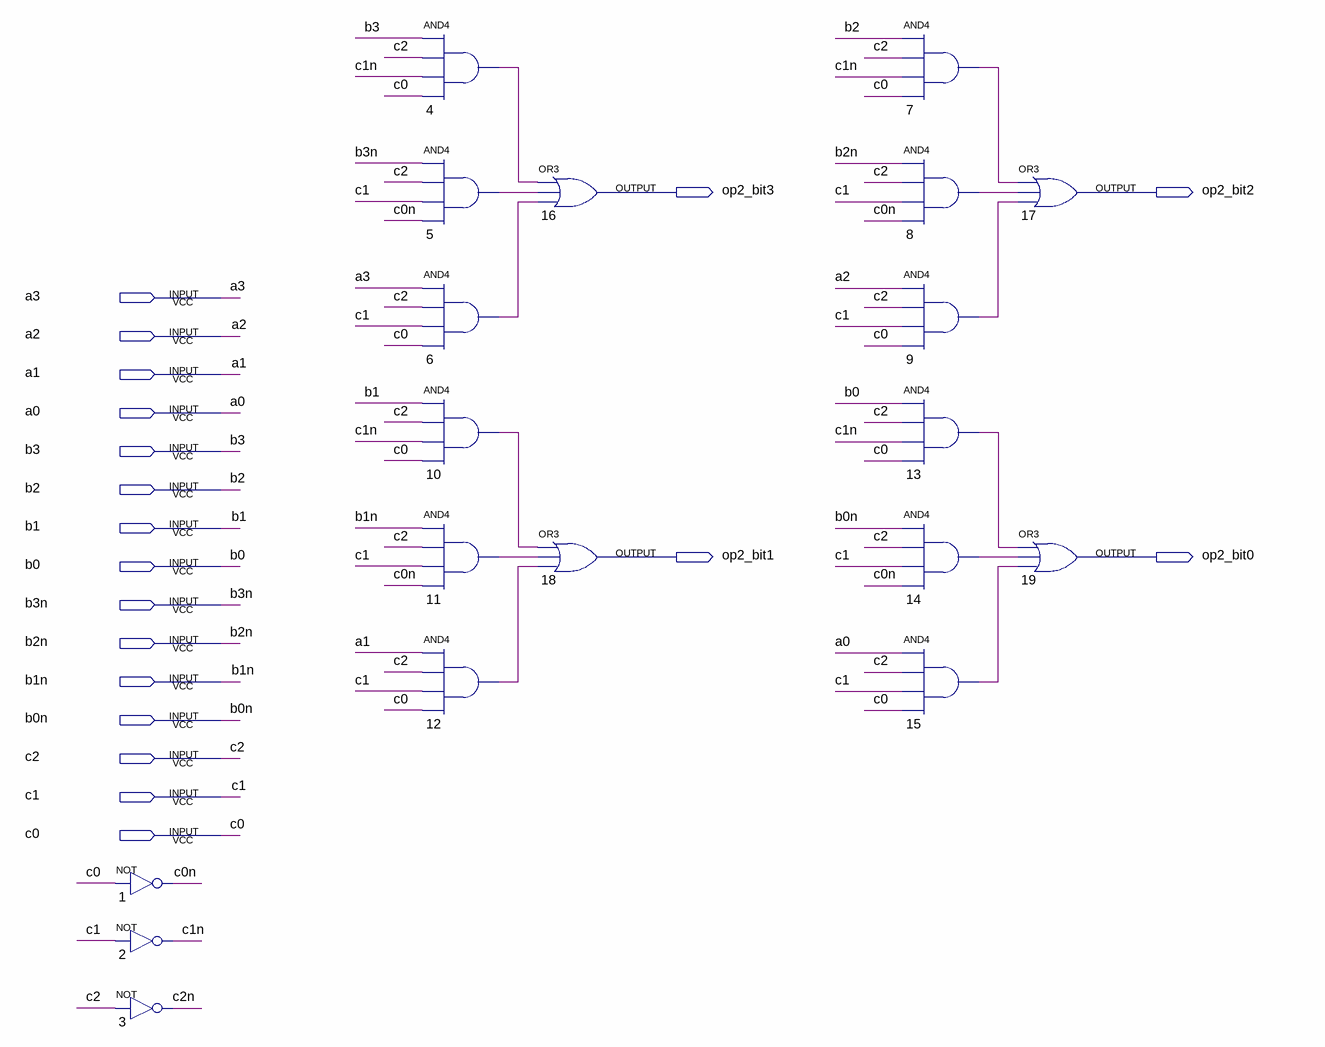
[diagram p0: schematic sheet]
// Quartus schematic mux_operando2soma.bdf as structural Verilog: 19 symbols, 19 pins
module mux_operando2soma (
  input  a3,
  input  a2,
  input  a1,
  input  a0,
  input  b3,
  input  b2,
  input  b1,
  input  b0,
  input  b3n,
  input  b2n,
  input  b1n,
  input  b0n,
  input  c2,
  input  c1,
  input  c0,
  output op2_bit3,
  output op2_bit2,
  output op2_bit1,
  output op2_bit0
);

  wire c0n, c1n, c2n, n4_out, n5_out, n6_out, n7_out, n8_out, n9_out, n10_out, n11_out, n12_out, n13_out,
       n14_out, n15_out;

  not u_1 (c0n, c0);
  not u_2 (c1n, c1);
  not u_3 (c2n, c2);
  and u_4 (n4_out, b3, c2, c1n, c0);
  and u_5 (n5_out, b3n, c2, c1, c0n);
  and u_6 (n6_out, a3, c2, c1, c0);
  and u_10 (n10_out, b1, c2, c1n, c0);
  and u_11 (n11_out, b1n, c2, c1, c0n);
  and u_12 (n12_out, a1, c2, c1, c0);
  or u_16 (op2_bit3, n4_out, n5_out, n6_out);
  or u_18 (op2_bit1, n10_out, n11_out, n12_out);
  and u_7 (n7_out, b2, c2, c1n, c0);
  and u_8 (n8_out, b2n, c2, c1, c0n);
  and u_9 (n9_out, a2, c2, c1, c0);
  and u_13 (n13_out, b0, c2, c1n, c0);
  and u_14 (n14_out, b0n, c2, c1, c0n);
  and u_15 (n15_out, a0, c2, c1, c0);
  or u_17 (op2_bit2, n7_out, n8_out, n9_out);
  or u_19 (op2_bit0, n13_out, n14_out, n15_out);
endmodule
